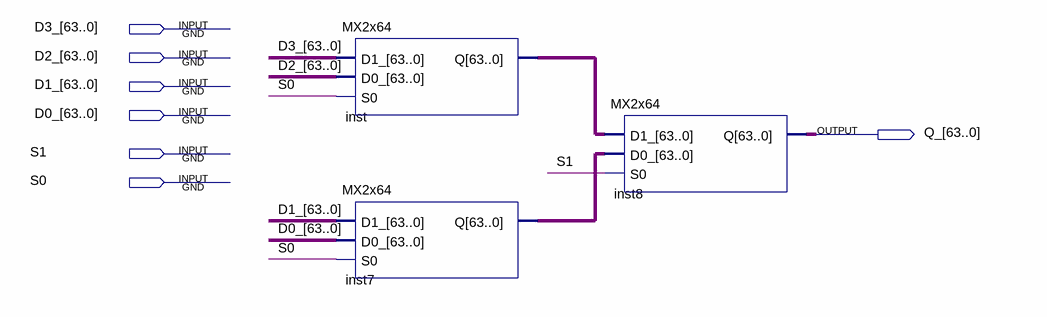
[diagram p0: schematic sheet]
// Quartus schematic MX4x64.bdf as structural Verilog: 3 symbols, 7 pins
module MX4x64 (
  input  [63:0] D3_,
  input  [63:0] D2_,
  input  [63:0] D1_,
  input  [63:0] D0_,
  input  S1,
  input  S0,
  output [63:0] Q_
);

  wire [63:0] inst7_q, inst_q;

  MX2x64 inst (.D1_(D3_), .D0_(D2_), .S0(S0), .Q(inst_q));
  MX2x64 inst7 (.D1_(D1_), .D0_(D0_), .S0(S0), .Q(inst7_q));
  MX2x64 inst8 (.D1_(inst_q), .D0_(inst7_q), .S0(S1), .Q(Q_));
endmodule
